# EAGLE schematic shield3 (EAGLE 7.3.0)
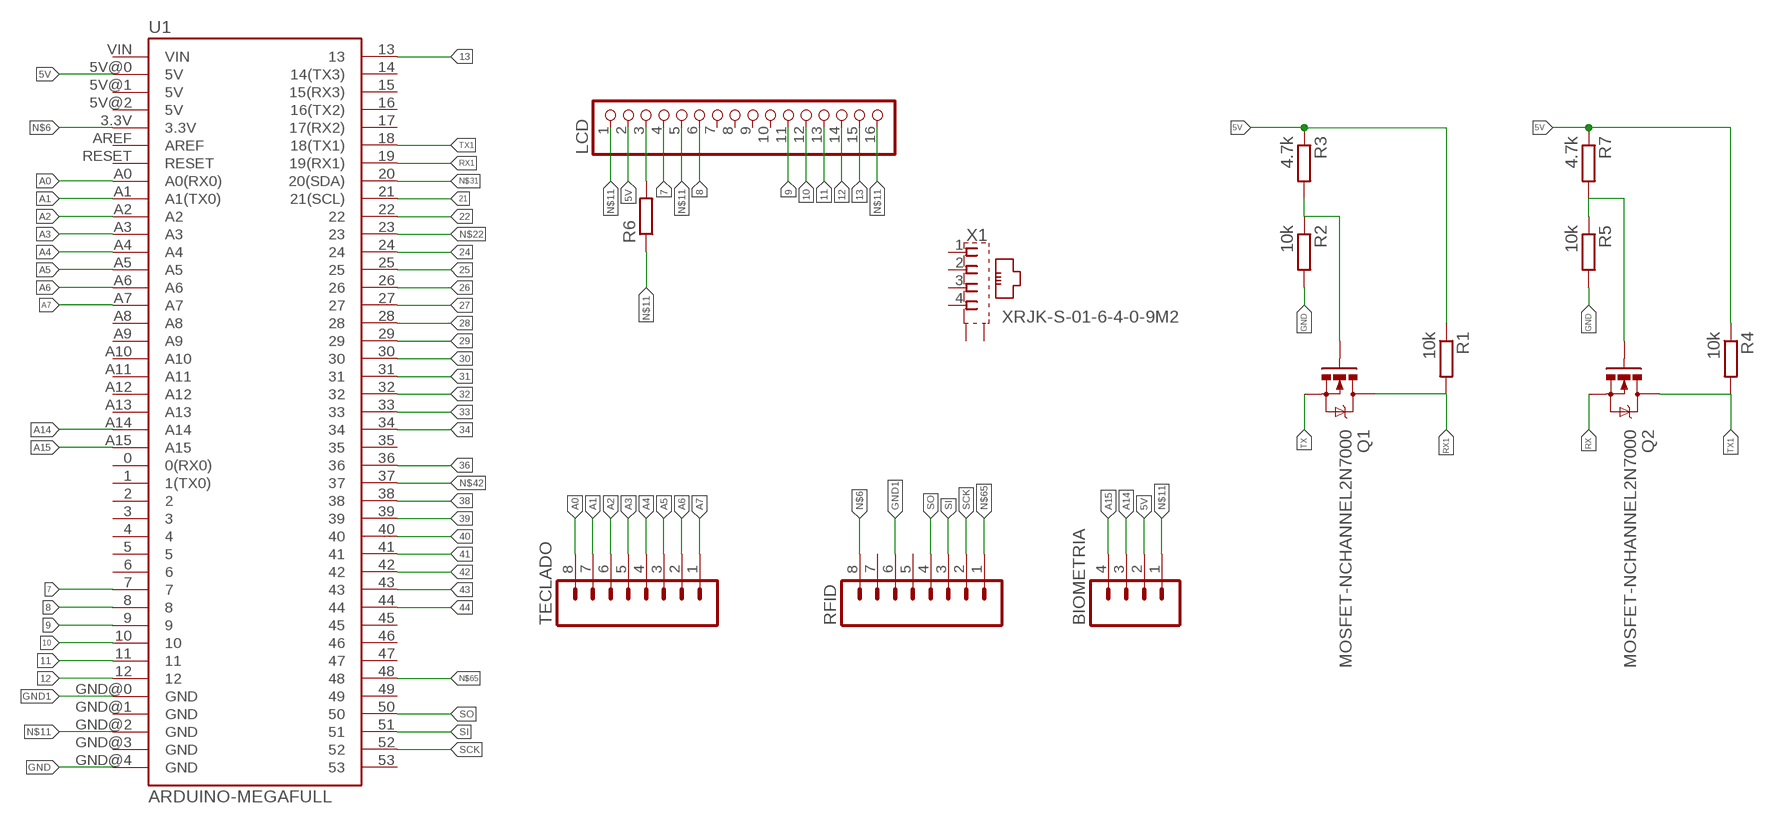
[diagram p0: schematic, sheet 1]

## Parts
BIOMETRIA  M04LONGPADS  [1X04_LONGPADS]
LCD  PINHD-1X16  [1X16]
Q1  MOSFET-NCHANNEL2N7000  [TO-92]
Q2  MOSFET-NCHANNEL2N7000  [TO-92]
R1  10k  R-EU_0204/7  [0204/7]
R2  10k  R-EU_0204/7  [0204/7]
R3  4.7k  R-EU_0204/7  [0204/7]
R4  10k  R-EU_0204/7  [0204/7]
R5  10k  R-EU_0204/7  [0204/7]
R6  R-EU_0309/12  [0309/12]
R7  4.7k  R-EU_0204/7  [0204/7]
RFID  M08LONGPADS  [1X08_LONGPADS]
TECLADO  M08LONGPADS  [1X08_LONGPADS]
U1  ARDUINO-MEGAFULL  [ARDUINO_MEGA]
X1  XRJK-S-01-6-4-0-9M2  [XRJK-S-01-6-4-0-9M2]

## Nets
5V: BIOMETRIA.2 LCD.2 R1.1 R3.1 R4.1 R7.1 U1.5V@0(5V)
7: LCD.4 U1.7
8: LCD.6 U1.8
9: LCD.11 U1.9
10: LCD.12 U1.10
11: LCD.13 U1.11
12: LCD.14 U1.12
13: LCD.15 U1.13
21: U1.21(21(SCL))
22: U1.22
24: U1.24
25: U1.25
26: U1.26
27: U1.27
28: U1.28
29: U1.29
30: U1.30
31: U1.31
32: U1.32
33: U1.33
34: U1.34
36: U1.36
38: U1.38
39: U1.39
40: U1.40
41: U1.41
42: U1.42
43: U1.43
44: U1.44
A0: TECLADO.8 U1.A0(A0(RX0))
A1: TECLADO.7 U1.A1(A1(TX0))
A2: TECLADO.6 U1.A2
A3: TECLADO.5 U1.A3
A4: TECLADO.4 U1.A4
A5: TECLADO.3 U1.A5
A6: TECLADO.2 U1.A6
A7: TECLADO.1 U1.A7
A14: BIOMETRIA.3 U1.A14
A15: BIOMETRIA.4 U1.A15
GND: R2.2 R5.2 U1.GND@4(GND)
GND1: RFID.6 U1.GND@0(GND)
N$1: Q1.2(G) R2.1 R3.2
N$2: Q2.2(G) R5.1 R7.2
N$3: LCD.3 R6.2
N$6: RFID.8 U1.3.3V
N$11: BIOMETRIA.1 LCD.1 LCD.5 LCD.16 R6.1 U1.GND@2(GND)
N$22: U1.23
N$31: U1.20(20(SDA))
N$42: U1.37
N$65: RFID.1 U1.48
RX: Q2.1(S)
RX1: Q1.3(D) R1.2 U1.19(19(RX1))
SCK: RFID.2 U1.52
SI: RFID.3 U1.51
SO: RFID.4 U1.50
TX: Q1.1(S)
TX1: Q2.3(D) R4.2 U1.18(18(TX1))
Unconnected: LCD.7 LCD.8 LCD.9 LCD.10 RFID.5 RFID.7 U1.0(0(RX0)) U1.1(1(TX0)) U1.2 U1.3 U1.4 U1.5 U1.5V@1(5V) U1.5V@2(5V) U1.6 U1.14(14(TX3)) U1.15(15(RX3)) U1.16(16(TX2)) U1.17(17(RX2)) U1.35 U1.45 U1.46 U1.47 U1.49 U1.53 U1.A8 U1.A9 U1.A10 U1.A11 U1.A12 U1.A13 U1.AREF U1.GND@1(GND) U1.GND@3(GND) U1.RESET U1.VIN X1.1 X1.2 X1.3 X1.4 X1.S1(S) X1.S2(S)

## Library data of the parts
BIOMETRIA = SparkFun-Connectors:M04: Header 4 Standard 4-pin 0.1" header. Use with straight break away headers (SKU : PRT-00116), right angle break away headers (PRT-00553), swiss pins (PRT-00743), machine pins (PRT-00117), and female headers (PRT-00115). Molex polarized connector foot print use with SKU : PRT-08231 with associated crimp pins and housings. 1MM SMD Version SKU: PRT-10208
LCD = pinhead:PINHD-1X16: PIN HEADER
Q1 Q2 = SparkFun-DiscreteSemi:MOSFET-NCHANNEL: Common NMOSFET Parts MFG P/N Store ID Prod ID FDD8780 TRANS-09984 SI7820DN TRANS-11055 FDS6630A IC-08089 2N7002PW TRANS-11151 FQP30N06L COM-10213 TRANS-10060 BSS123LT1G TRANS-08345 BSS138 TRANS-00830 BS170 2N7000
R1-R7 = resistor:R-EU_: RESISTOR, European symbol
RFID TECLADO = SparkFun-Connectors:M08: Header 8 Standard 8-pin 0.1" header. Use with straight break away headers (SKU : PRT-00116), right angle break away headers (PRT-00553), swiss pins (PRT-00743), machine pins (PRT-00117), and female headers (PRT-00115).
U1 = SparkFun-Boards:ARDUINO-MEGA: Arduino Mega board footprint
X1 = con-xmultiple:XRJK*4: RJ11 Connector without LED, 6 position, 4 contacts, thrue hole Source: XRJK-S-01-6-4-0-9M2(01).pdf